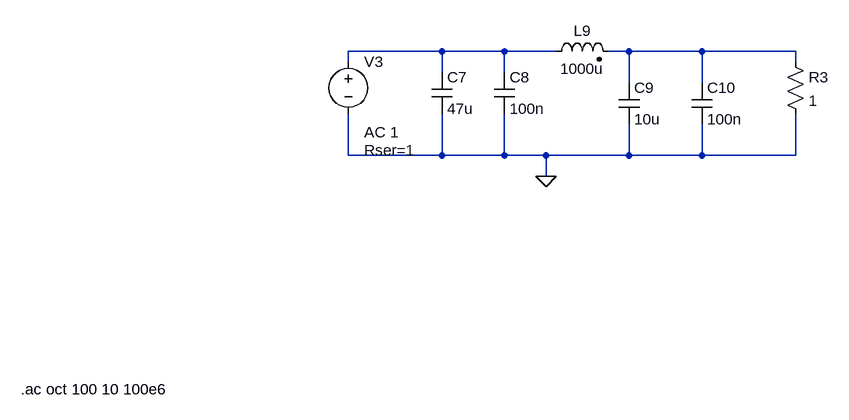
[diagram p0: schematic smps-filter.asc]
smps-filter.asc, the LTspice schematic file:
Version 4
SHEET 1 1608 680
WIRE 1008 -176 864 -176
WIRE 1104 -176 1008 -176
WIRE 1184 -176 1104 -176
WIRE 1296 -176 1264 -176
WIRE 1408 -176 1296 -176
WIRE 1552 -176 1408 -176
WIRE 864 -160 864 -176
WIRE 1552 -160 1552 -176
WIRE 1008 -144 1008 -176
WIRE 1104 -144 1104 -176
WIRE 1296 -128 1296 -176
WIRE 1408 -128 1408 -176
WIRE 864 -16 864 -80
WIRE 1008 -16 1008 -80
WIRE 1008 -16 864 -16
WIRE 1104 -16 1104 -80
WIRE 1104 -16 1008 -16
WIRE 1168 -16 1104 -16
WIRE 1296 -16 1296 -64
WIRE 1296 -16 1168 -16
WIRE 1408 -16 1408 -64
WIRE 1408 -16 1296 -16
WIRE 1552 -16 1552 -80
WIRE 1552 -16 1408 -16
WIRE 1168 16 1168 -16
FLAG 1168 16 0
SYMBOL voltage 864 -176 R0
WINDOW 123 24 124 Left 2
WINDOW 39 24 152 Left 2
SYMATTR Value2 AC 1
SYMATTR SpiceLine Rser=1
SYMATTR InstName V3
SYMATTR Value ""
SYMBOL ind2 1168 -160 R270
WINDOW 0 32 56 VTop 2
WINDOW 3 5 56 VBottom 2
SYMATTR InstName L9
SYMATTR Value 1000u
SYMATTR Type ind
SYMATTR SpiceLine Rser=0.014
SYMBOL cap 992 -144 R0
SYMATTR InstName C7
SYMATTR Value 47u
SYMATTR SpiceLine Rser=0.1
SYMBOL res 1536 -176 R0
SYMATTR InstName R3
SYMATTR Value 1
SYMBOL cap 1088 -144 R0
SYMATTR InstName C8
SYMATTR Value 100n
SYMATTR SpiceLine Rser=0.1
SYMBOL cap 1280 -128 R0
SYMATTR InstName C9
SYMATTR Value 10u
SYMATTR SpiceLine Rser=0.1
SYMBOL cap 1392 -128 R0
SYMATTR InstName C10
SYMATTR Value 100n
SYMATTR SpiceLine Rser=0.1
TEXT 360 344 Left 2 !.ac oct 100 10 100e6

The netlist it stands for:
* smps-filter.asc
V3 N001 0 AC 1 Rser=1
L9 N001 N002 1000u Rser=0.014
C7 N001 0 47u Rser=0.1
R3 N002 0 1
C8 N001 0 100n Rser=0.1
C9 N002 0 10u Rser=0.1
C10 N002 0 100n Rser=0.1
.ac oct 100 10 100e6
.backanno
.end